# Altium schematic sheet CHM_CPU_FPGA_EEPROM.SchDoc
size A3
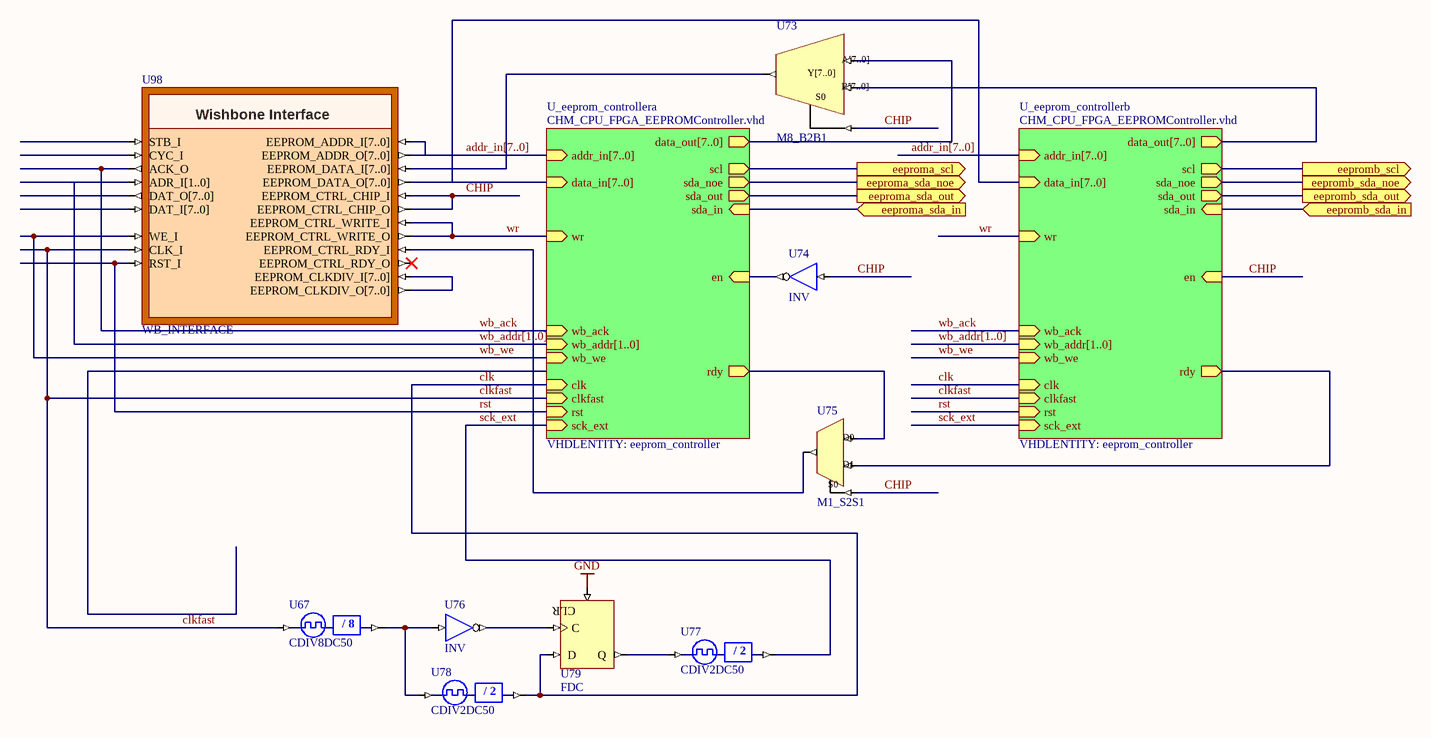
[diagram p0: CHM_CPU_FPGA_EEPROM.SchDoc]

## Parts
U67  CDIV8DC50
U73  M8_B2B1
U74  INV
U75  M1_S2S1
U76  INV
U77  CDIV2DC50
U78  CDIV2DC50
U79  FDC
U98  WB_INTERFACE

## Sub-sheets
U_eeprom_controllera = CHM_CPU_FPGA_EEPROMController.vhd: addr_in[7..0] (in), clk (in), data_in[7..0] (in), data_out[7..0] (out), rdy (out), sck_ext (in), scl (out), sda_in (in), sda_noe (out), sda_out (out), wb_ack (in), wb_addr[1..0] (in), wb_we (in), wr (in), clkfast (in), rst (in), en (in)  | VHDLENTITY: eeprom_controller
U_eeprom_controllerb = CHM_CPU_FPGA_EEPROMController.vhd: addr_in[7..0] (in), clk (in), data_in[7..0] (in), data_out[7..0] (out), rdy (out), sck_ext (in), scl (out), sda_in (in), sda_noe (out), sda_out (out), wb_ack (in), wb_addr[1..0] (in), wb_we (in), wr (in), clkfast (in), rst (in), en (in)  | VHDLENTITY: eeprom_controller

## Ports
eeproma_scl (out), eeproma_sda_in (in), eeproma_sda_noe (out), eeproma_sda_out (out), eepromb_scl (out), eepromb_sda_in (in), eepromb_sda_noe (out), eepromb_sda_out (out)

## Nets
GND: U79.CLR
addr_in[7..0]: U98.EEPROM_ADDR_I[7..0] U98.EEPROM_ADDR_O[7..0] ; sheet U_eeprom_controllera/addr_in[7..0], sheet U_eeprom_controllerb/addr_in[7..0]
CHIP: U73.S0 U74.I U75.S0 U98.EEPROM_CTRL_CHIP_I U98.EEPROM_CTRL_CHIP_O ; sheet U_eeprom_controllerb/en
clk: U78.CLKDV U79.D ; sheet U_eeprom_controllera/clk, sheet U_eeprom_controllerb/clk
clkfast: U67.CLKIN U98.CLK_I ; sheet U_eeprom_controllera/clkfast, sheet U_eeprom_controllerb/clkfast
eeproma_scl: port eeproma_scl, sheet U_eeprom_controllera/scl
eeproma_sda_in: port eeproma_sda_in, sheet U_eeprom_controllera/sda_in
eeproma_sda_noe: port eeproma_sda_noe, sheet U_eeprom_controllera/sda_noe
eeproma_sda_out: port eeproma_sda_out, sheet U_eeprom_controllera/sda_out
eepromb_scl: port eepromb_scl, sheet U_eeprom_controllerb/scl
eepromb_sda_in: port eepromb_sda_in, sheet U_eeprom_controllerb/sda_in
eepromb_sda_noe: port eepromb_sda_noe, sheet U_eeprom_controllerb/sda_noe
eepromb_sda_out: port eepromb_sda_out, sheet U_eeprom_controllerb/sda_out
rst: U98.RST_I ; sheet U_eeprom_controllera/rst, sheet U_eeprom_controllerb/rst
sck_ext: U77.CLKDV ; sheet U_eeprom_controllera/sck_ext, sheet U_eeprom_controllerb/sck_ext
wb_ack: U98.ACK_O ; sheet U_eeprom_controllera/wb_ack, sheet U_eeprom_controllerb/wb_ack
wb_addr[1..0]: U98.ADR_I[1..0] ; sheet U_eeprom_controllera/wb_addr[1..0], sheet U_eeprom_controllerb/wb_addr[1..0]
wb_we: U98.WE_I ; sheet U_eeprom_controllera/wb_we, sheet U_eeprom_controllerb/wb_we
wr: U98.EEPROM_CTRL_WRITE_I U98.EEPROM_CTRL_WRITE_O ; sheet U_eeprom_controllera/wr, sheet U_eeprom_controllerb/wr
NetU67_CLKDV: U67.CLKDV U76.I U78.CLKIN
NetU73_A[7..0]: U73.A[7..0] ; sheet U_eeprom_controllera/data_out[7..0]
NetU73_B[7..0]: U73.B[7..0] ; sheet U_eeprom_controllerb/data_out[7..0]
NetU73_Y[7..0]: U73.Y[7..0] U98.EEPROM_DATA_I[7..0]
NetU74_O: U74.O ; sheet U_eeprom_controllera/en
NetU75_D0: U75.D0 ; sheet U_eeprom_controllera/rdy
NetU75_D1: U75.D1 ; sheet U_eeprom_controllerb/rdy
NetU75_O: U75.O U98.EEPROM_CTRL_RDY_I
NetU76_O: U76.O U79.C
NetU77_CLKIN: U77.CLKIN U79.Q
NetU98_EEPROM_CLKDIV_I[7..0]: U98.EEPROM_CLKDIV_I[7..0] U98.EEPROM_CLKDIV_O[7..0]
NetU98_EEPROM_DATA_O[7..0]: U98.EEPROM_DATA_O[7..0] ; sheet U_eeprom_controllera/data_in[7..0], sheet U_eeprom_controllerb/data_in[7..0]

Not connected (* = marked no-connect by the designer): U98 CYC_I DAT_I[7..0] DAT_O[7..0] EEPROM_CTRL_RDY_O* STB_I

## Buses and harness runs
bus addr_in[7..0] = sheet U_eeprom_controllera/addr_in[7..0]
bus addr_in[7..0] = sheet U_eeprom_controllerb/addr_in[7..0]
bus sheet U_eeprom_controllera/data_in[7..0] = sheet U_eeprom_controllerb/data_in[7..0]
bus wb_addr[1..0] = sheet U_eeprom_controllera/wb_addr[1..0]
bus wb_addr[1..0] = sheet U_eeprom_controllerb/wb_addr[1..0]

## Notes on the sheet
- (in symbol CDIV2DC50) / 2
- (in symbol CDIV8DC50) / 8
- (in symbol WB_INTERFACE) Wishbone Interface

## Library data of the parts
U67 = CDIV8DC50: Clock Divider by 8 with 50% Duty Cycle Output; XilinxEquivalent: CLK_DIV8; DivisorRate: 8; DutyCycle: 50; ArchiveName: GENERIC; VHDLIB_SIM: GENERIC_LIB; Published: 29-Jan-2004; Publisher: Altium Limited; LastRevisionNo: 1.00.00; HelpURL: CR0118 FPGA Generic Library Guide.pdf#page=143; ComponentLink1URL: CR0127 FPGA Clock Divider Resource Usage.pdf#page=12; ComponentLink1Description: Core &Resource Usage; FunctionalClass: Clock Divider
U73 = M8_B2B1: 2x8-Bit Bus to 1x8-Bit Bus Multiplexer; SubClass: BnB1; PortSize: 8; PortStyle: Bus Version; ArchiveName: GENERIC; VHDLIB_SIM: GENERIC_LIB; Published: 29-Jan-2004; Publisher: Altium Limited; LastRevisionNo: 1.00.00; HelpURL: CR0118 FPGA Generic Library Guide.pdf#page=364; ComponentLink1URL: CR0137 FPGA Multiplexer Resource Usage.pdf#page=302; ComponentLink1Description: Core &Resource Usage; FunctionalClass: Multiplexer
U74 U76 = INV: Inverter; FunctionalClass: Logic Primitive; ArchiveName: GENERIC; VHDLIB_SIM: GENERIC_LIB; Published: 29-Jan-2004; Publisher: Altium Limited; XilinxEquivalent: INV; LastRevisionNo: 1.00.00; HelpURL: CR0118 FPGA Generic Library Guide.pdf#page=291; ComponentLink1URL: CR0136 FPGA Logic Primitive Resource Usage.pdf#page=61; ComponentLink1Description: Core &Resource Usage; SubClass: INV
U75 = M1_S2S1: 2x1-Single Wire to 1x1-Single Wire Multiplexer; XilinxEquivalent: M2_1; SubClass: SnS1; PortSize: 1; PortStyle: Single Pin Version; ArchiveName: GENERIC; VHDLIB_SIM: GENERIC_LIB; Published: 29-Jan-2004; Publisher: Altium Limited; LastRevisionNo: 1.00.00; HelpURL: CR0118 FPGA Generic Library Guide.pdf#page=364; ComponentLink1URL: CR0137 FPGA Multiplexer Resource Usage.pdf#page=50; ComponentLink1Description: Core &Resource Usage; FunctionalClass: Multiplexer
U77 U78 = CDIV2DC50: Clock Divider by 2 with 50% Duty Cycle Output; XilinxEquivalent: CLK_DIV2; DivisorRate: 2; DutyCycle: 50; ArchiveName: GENERIC; VHDLIB_SIM: GENERIC_LIB; Published: 29-Jan-2004; Publisher: Altium Limited; LastRevisionNo: 1.00.00; HelpURL: CR0118 FPGA Generic Library Guide.pdf#page=143; ComponentLink1URL: CR0127 FPGA Clock Divider Resource Usage.pdf#page=3; ComponentLink1Description: Core &Resource Usage; FunctionalClass: Clock Divider
U79 = FDC: D-Type Flip-Flop with Asynchronous Clear; SubClass: FD; ClockTrigger: Rising; ArchiveName: GENERIC; VHDLIB_SIM: GENERIC_LIB; Published: 29-Jan-2004; Publisher: Altium Limited; XilinxEquivalent: FDC; LastRevisionNo: 1.00.00; HelpURL: CR0118 FPGA Generic Library Guide.pdf#page=172; ComponentLink1URL: CR0133 FPGA Flip Flop Resource Usage.pdf#page=150; ComponentLink1Description: Core &Resource Usage; FunctionalClass: Flip-Flop; Reset: Asynchronous
U98 = WB_INTERFACE: Custom Wishbone Interface; ConfigurationParameters: {}Version[1.1]{}DataBusWidth[8]{}AddrBusWidth[2]{}ChannelCount[1]{}ItemType0[0]{}Name0[EEPROM_ADDR]{}DataWidth0[8]{}Address0[00]{}Space0[0]{}Acknowledge0[True]{}ItemAccessType0[2]{}ItemType1[0]{}Name1[EEPROM_DATA]{}DataWidth1[8]{}Address1[01]{}Space1[0]{}Acknowledge1[True]{}ItemAccessType1[2]{}ItemType2[0]{}Name2[EEPROM_CTRL]{}DataWidth2[8]{}Address2[10]{}Space2[0]{}Acknowledge2[True]{}ItemAccessType2[2]{}Slices2_StartBit0[0]{}Slices2_EndBit0[0]{}Slices2_Name0[CHIP]{}Slices2_StartBit1[1]{}Slices2_EndBit1[1]{}Slices2_Name1[WRITE]{}Slices2_StartBit2[2]{}Slices2_EndBit2[2]{}Slices2_Name2[RDY]{}ItemType3[0]{}Name3[EEPROM_CLKDIV]{}DataWidth3[8]{}Address3[11]{}Space3[0]{}Acknowledge3[True]{}ItemAccessType3[2]{}; UseInDSF: False; LastRevisionNo: 1.00.00; Published: 14-Feb-2008; Publisher: Altium Limited; ConfiguratorName: WB_INTERFACE; HelpURL: https://wiki.altium.com/display/ADOH/WB_INTERFACE+-+Custom+Wishbone+Interface